# Altium project classyTKL_MX.PrjPcb
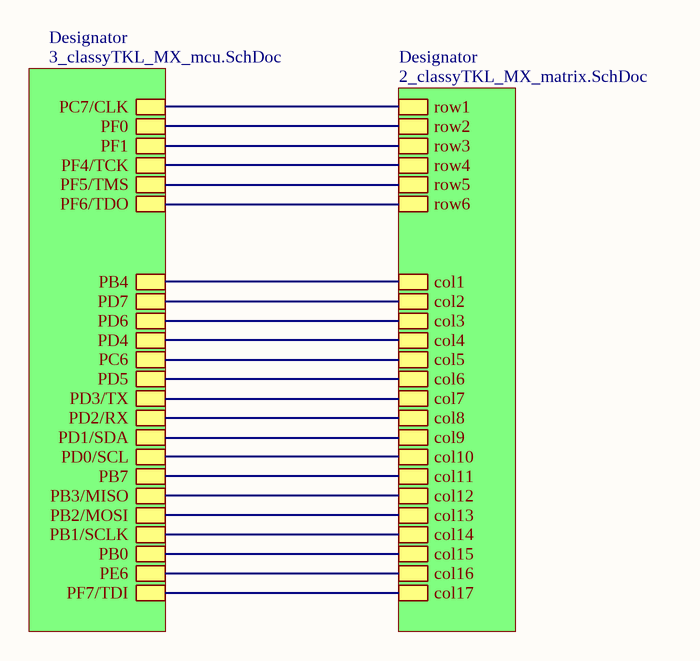
[diagram p0: 1_classyTKL_MX_top.SchDoc]
3 sheets, 205 parts. Net scope: hierarchical (ports join the sheet entries above them; power ports are global).
Board files: classyTKL_MX.PcbDoc, classyTKL_MX_plate.PcbDoc
Sheets:
  1_classyTKL_MX_top.SchDoc
    Designator = 3_classyTKL_MX_mcu.SchDoc
    Designator = 2_classyTKL_MX_matrix.SchDoc

## Sheet 1_classyTKL_MX_top.SchDoc: ClassyTKL - MX
size A4; Engineer: 4pplet; Address1: github.com/4pplet/classytkl; Address2: Licence: CERN-OHL-S; Revision: A3; SheetNumber: 1; SheetTotal: 3; ProjectName: waffling60

### Sub-sheets
Designator = 3_classyTKL_MX_mcu.SchDoc: PD5, PB4, PD6, PB0, PB2/MOSI, PB3/MISO, PD7, PC7/CLK, PE6, PF0, PF1, PF5/TMS, PD2/RX, PF4/TCK, PF7/TDI, PF6/TDO, PD4, PB1/SCLK, PD0/SCL, PC6, PB7, PD1/SDA, PD3/TX
Designator = 2_classyTKL_MX_matrix.SchDoc: col6, col8, col5, col7, col3, col2, col1, col4, col9, row3, row1, row4, row2, row6, row5, col10, col11, col14, col15, col13, col12, col16, col17

### Nets
col1: sheet Designator/PB4, sheet Designator/col1
col2: sheet Designator/PD7, sheet Designator/col2
col3: sheet Designator/PD6, sheet Designator/col3
col4: sheet Designator/PD4, sheet Designator/col4
col5: sheet Designator/PC6, sheet Designator/col5
col6: sheet Designator/PD5, sheet Designator/col6
col7: sheet Designator/PD3/TX, sheet Designator/col7
col8: sheet Designator/PD2/RX, sheet Designator/col8
col9: sheet Designator/PD1/SDA, sheet Designator/col9
col10: sheet Designator/PD0/SCL, sheet Designator/col10
col11: sheet Designator/PB7, sheet Designator/col11
col12: sheet Designator/PB3/MISO, sheet Designator/col12
col13: sheet Designator/PB2/MOSI, sheet Designator/col13
col14: sheet Designator/PB1/SCLK, sheet Designator/col14
col15: sheet Designator/PB0, sheet Designator/col15
col16: sheet Designator/PE6, sheet Designator/col16
col17: sheet Designator/PF7/TDI, sheet Designator/col17
PC7: sheet Designator/PC7/CLK, sheet Designator/row1
PF0: sheet Designator/PF0, sheet Designator/row2
PF1: sheet Designator/PF1, sheet Designator/row3
PF4: sheet Designator/PF4/TCK, sheet Designator/row4
PF5: sheet Designator/PF5/TMS, sheet Designator/row5
PF6: sheet Designator/PF6/TDO, sheet Designator/row6

### Notes on the sheet
- Title
- Size:
- Date:
- A4
- Number:
- Time:
- Revision:
- Sheet
- of
- File:

## Sheet 3_classyTKL_MX_mcu.SchDoc: ClassyTKL - MX
size A4; Address1: github.com/4pplet/classytkl; Address2: Licence: CERN-OHL-S; Revision: A3; SheetNumber: 3; SheetTotal: 3
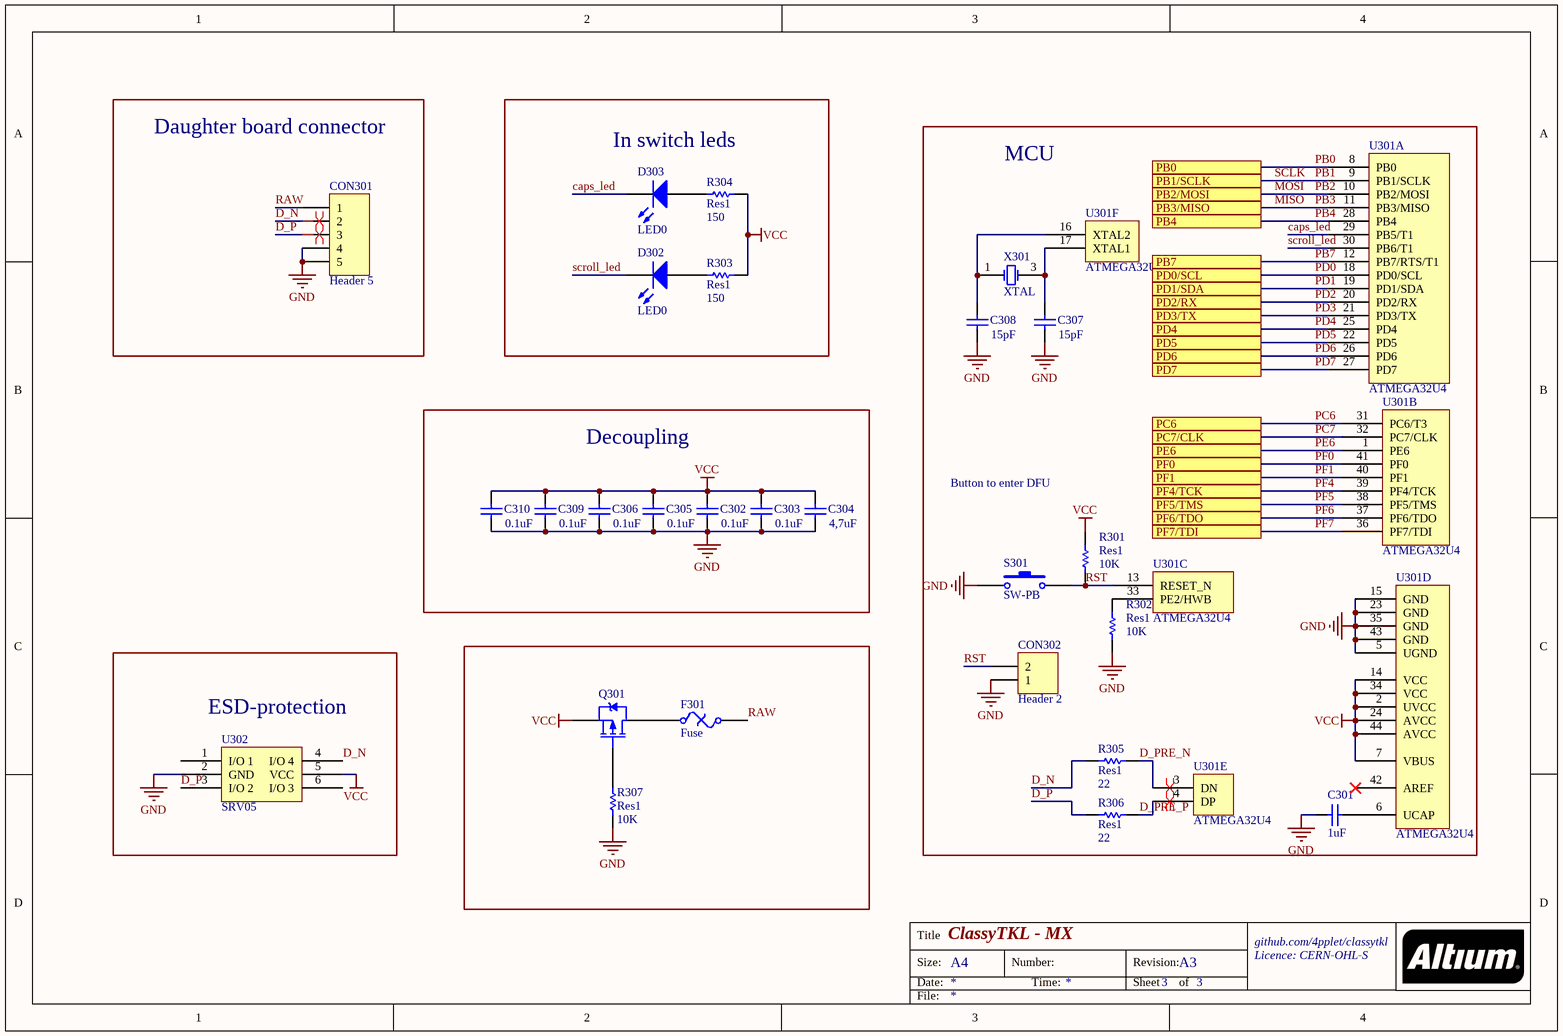
[diagram p1: 3_classyTKL_MX_mcu.SchDoc]

### Parts
C301  value 1uF  [C0603[1608]]
C302  value 0.1uF  [C0603[1608]]
C303  value 0.1uF  [C0603[1608]]
C304  value 4,7uF  [C0603[1608]]
C305  value 0.1uF  [C0603[1608]]
C306  value 0.1uF  [C0603[1608]]
C307  value 15pF  [C0603[1608]]
C308  value 15pF  [C0603[1608]]
C309  value 0.1uF  [C0603[1608]]
C310  value 0.1uF  [C0603[1608]]
CON301  Header 5  [JST SM04B-SRSS-TB]
CON302  Header 2  [HDR1X2]  (no BOM)
D302  LED0  [MX-switch - LED]  (no BOM)
D303  LED0  [MX-switch - CAPS - LED NO SWITCH]  (no BOM)
F301  Fuse  [C1206[3216]]
Q301  PMOS-2  [SOT-23-3]  (value not drawn)
R301  Res1  value 10K  [R0603[1608]]
R302  Res1  value 10K  [R0603[1608]]
R303  Res1  value 150  [R0603[1608] - THT]  (no BOM)
R304  Res1  value 150  [R0603[1608] - THT]  (no BOM)
R305  Res1  value 22  [R0603[1608]]
R306  Res1  value 22  [R0603[1608]]
R307  Res1  value 10K  [R0603[1608]]
S301  SW-PB  [XKB Switch]
U301  ATMEGA32U4  [ATMEGA32U4-COMBO]  (parts A,B,C,D,E,F of 6)
U302  SRV05  [SOT-23-6]
X301  XTAL  [XTAL-3225]

### Blocks framed on the sheet
Daughter board connector: CON301
In switch leds: D302 D303 R303 R304
MCU: C301 C307 C308 CON302 R301 R302 R305 R306 S301 U301 X301
Decoupling: C302-C306 C309 C310
ESD-protection: U302

### Ports
PB0, PB1/SCLK, PB2/MOSI, PB3/MISO, PB4, PB7, PC6, PC7/CLK, PD0/SCL, PD1/SDA, PD2/RX, PD3/TX, PD4, PD5, PD6, PD7, PE6, PF0, PF1, PF4/TCK, PF5/TMS, PF6/TDO, PF7/TDI

### Nets
GND: C301.1 C302.1 C303.1 C304.1 C305.1 C306.1 C307.1 C308.1 C309.1 C310.1 CON301.4 CON301.5 CON302.1 R302.2 R307.2 S301.2 U301.5(UGND) U301.15(GND) U301.23(GND) U301.35(GND) U301.43(GND) U302.2(GND) X301.2(GND) X301.4(GND)
VCC: C302.2 C303.2 C304.2 C305.2 C306.2 C309.2 C310.2 Q301.2(S) R301.1 R303.1 R304.1 U301.2(UVCC) U301.7(VBUS) U301.14(VCC) U301.24(AVCC) U301.34(VCC) U301.44(AVCC) U302.5(VCC)
caps_led: D303.2(K) U301.29(PB5/T1)
D_N: CON301.2 R305.2 U302.4(I/O_4)
D_P: CON301.3 R306.2 U302.3(I/O_2)
D_PRE_N: R305.1 U301.3(DN)
D_PRE_P: R306.1 U301.4(DP)
MISO: U301.11(PB3/MISO) ; port PB3/MISO  [also labelled PB3]  [project net col12]
MOSI: U301.10(PB2/MOSI) ; port PB2/MOSI  [also labelled PB2]  [project net col13]
PB0: U301.8(PB0) ; port PB0  [project net col15]
PB1: U301.9(PB1/SCLK) ; port PB1/SCLK  [also labelled SCLK]  [project net col14]
PB4: U301.28(PB4) ; port PB4  [project net col1]
PB7: U301.12(PB7/RTS/T1) ; port PB7  [project net col11]
PC6: U301.31(PC6/T3) ; port PC6  [project net col5]
PC7: U301.32(PC7/CLK) ; port PC7/CLK
PD0: U301.18(PD0/SCL) ; port PD0/SCL  [project net col10]
PD1: U301.19(PD1/SDA) ; port PD1/SDA  [project net col9]
PD2: U301.20(PD2/RX) ; port PD2/RX  [project net col8]
PD3: U301.21(PD3/TX) ; port PD3/TX  [project net col7]
PD4: U301.25(PD4) ; port PD4  [project net col4]
PD5: U301.22(PD5) ; port PD5  [project net col6]
PD6: U301.26(PD6) ; port PD6  [project net col3]
PD7: U301.27(PD7) ; port PD7  [project net col2]
PE6: U301.1(PE6) ; port PE6  [project net col16]
PF0: U301.41(PF0) ; port PF0
PF1: U301.40(PF1) ; port PF1
PF4: U301.39(PF4/TCK) ; port PF4/TCK
PF5: U301.38(PF5/TMS) ; port PF5/TMS
PF6: U301.37(PF6/TDO) ; port PF6/TDO
PF7: U301.36(PF7/TDI) ; port PF7/TDI  [project net col17]
RAW: CON301.1 F301.1
RST: CON302.2 R301.2 S301.1 U301.13(RESET_N)
scroll_led: D302.2(K) U301.30(PB6/T1)
NetC301_2: C301.2 U301.6(UCAP)
NetC307_2: C307.2 U301.17(XTAL1) X301.3(OSC2)
NetC308_2: C308.2 U301.16(XTAL2) X301.1(OSC1)
NetD302_1: D302.1(A) R303.2
NetD303_1: D303.1(A) R304.2
NetF301_2: F301.2 Q301.3(D)
NetQ301_1: Q301.1(G) R307.1
NetR302_1: R302.1 U301.33(PE2/HWB)

Not connected (* = marked no-connect by the designer): U301 42(AREF)*; U302 1(I/O_1) 6(I/O_3)

### Layout directives
differential pair: D_N, D_P, D_PRE_N, D_PRE_P

### Notes on the sheet
- Button to enter DFU
- Title
- Size:
- Date:
- A4
- Number:
- Time:
- Revision:
- Sheet
- of
- File:

### Library data of the parts
C301 = Cap: Capacitor; MRF.Part: CL10A105KB8NNNC; MFG: KEMET; MFGPN: C0603C104M5RACTU; LCSC MFG: Samsung Electro-Mechanics; Version: 0603 imperial; LCSC Part #: C15849
C302 C303 C305 C306 C309 C310 = Cap: Capacitor; MRF.Part: CC0603KRX7R9BB104; MFG: KEMET; MFGPN: C0603C104M5RACTU; LCSC MFG: YAGEO; Version: 0603 imperial; LCSC Part #: C14663
C304 = Cap: Capacitor; MRF.Part: CL10A475KO8NNNC; LCSC MFG: Samsung Electro-Mechanics; LCSC Part #: C19666
C307 C308 = Cap: Capacitor; MRF.Part: CL10C150JB8NNNC; LCSC MFG: Samsung Electro-Mechanics; Version: 0603 imperial; LCSC Part #: C1644
CON301 = Header 5: JST for USB daughter board; MFGPN: SM04B-SRSS-TB(LF)(SN); MFG: JST Sales America Inc.; LCSC MFG: JST Sales America; LCSC Part #: C160404; MRF.Part: SM04B-SRSS-TB(LF)(SN)
CON302 = Header 2: Header, 2-Pin
D302 D303 = LED0: Typical INFRARED GaAs LED
F301 = Fuse Thermal: Thermal Fuse; MRF.Part: ASMD1206-050; MFG: Bel Fuse Inc.; MFGPN: 0ZCJ0050FF2G; LCSC MFG: Shenzhen JDT Fuse; LCSC Part #: C135338
Q301 = PMOS-2: P-Channel Power MOSFET; MRF.Part: SI2301CDS-T1-GE3; LCSC MFG: Vishay Intertech; LCSC Part #: C10487; Version: SOT23-3
R301 R302 R307 = Res1: Resistor; MRF.Part: 0603WAF1002T5E; MFG: Panasonic Electronic Components; MFGPN: ERJ-3EKF5101V; LCSC MFG: Uniroyal Elec; Version: 0603 imperial; LCSC Part #: C25804
R303 R304 = Res1: Resistor; Version: 0603 imperial
R305 R306 = Res1: Resistor; MRF.Part: 0603WAF220JT5E; MFG: Panasonic Electronic Components; MFGPN: ERJ-3EKF5101V; LCSC MFG: Uniroyal Elec; Version: 0603 imperial; LCSC Part #: C23345
S301 = SW-PB: Switch; MRF.Part: TS-1187A-C-D-B; MFGPN: PTS645SM43SMTR92 LFS; MFG: C&K; LCSC MFG: XKB Enterprise; LCSC Part #: C318888
U301 = ATMEGA32U4: MCU; LCSC MFG: Microchip Tech; MFG: Microchip Technology; MFGPN: ATMEGA32U4-MUR; LCSC Part #: C45874; MRF.Part: ATMEGA32U4-MUR
U302 = SRV05: MRF.Part: SRV05-4-P-T7; LCSC MFG: ProTek Devices; LCSC Part #: C85364
X301 = XTAL: Crystal Oscillator; MRF.Part: X322516MLB4SI; LCSC MFG: Yangxing Tech; LCSC Part #: C13738

## Sheet 2_classyTKL_MX_matrix.SchDoc: ClassyTKL - MX
size A2; Address1: github.com/4pplet/classytkl; Address2: Licence: CERN-OHL-S; Revision: A3; SheetNumber: 2; SheetTotal: 3
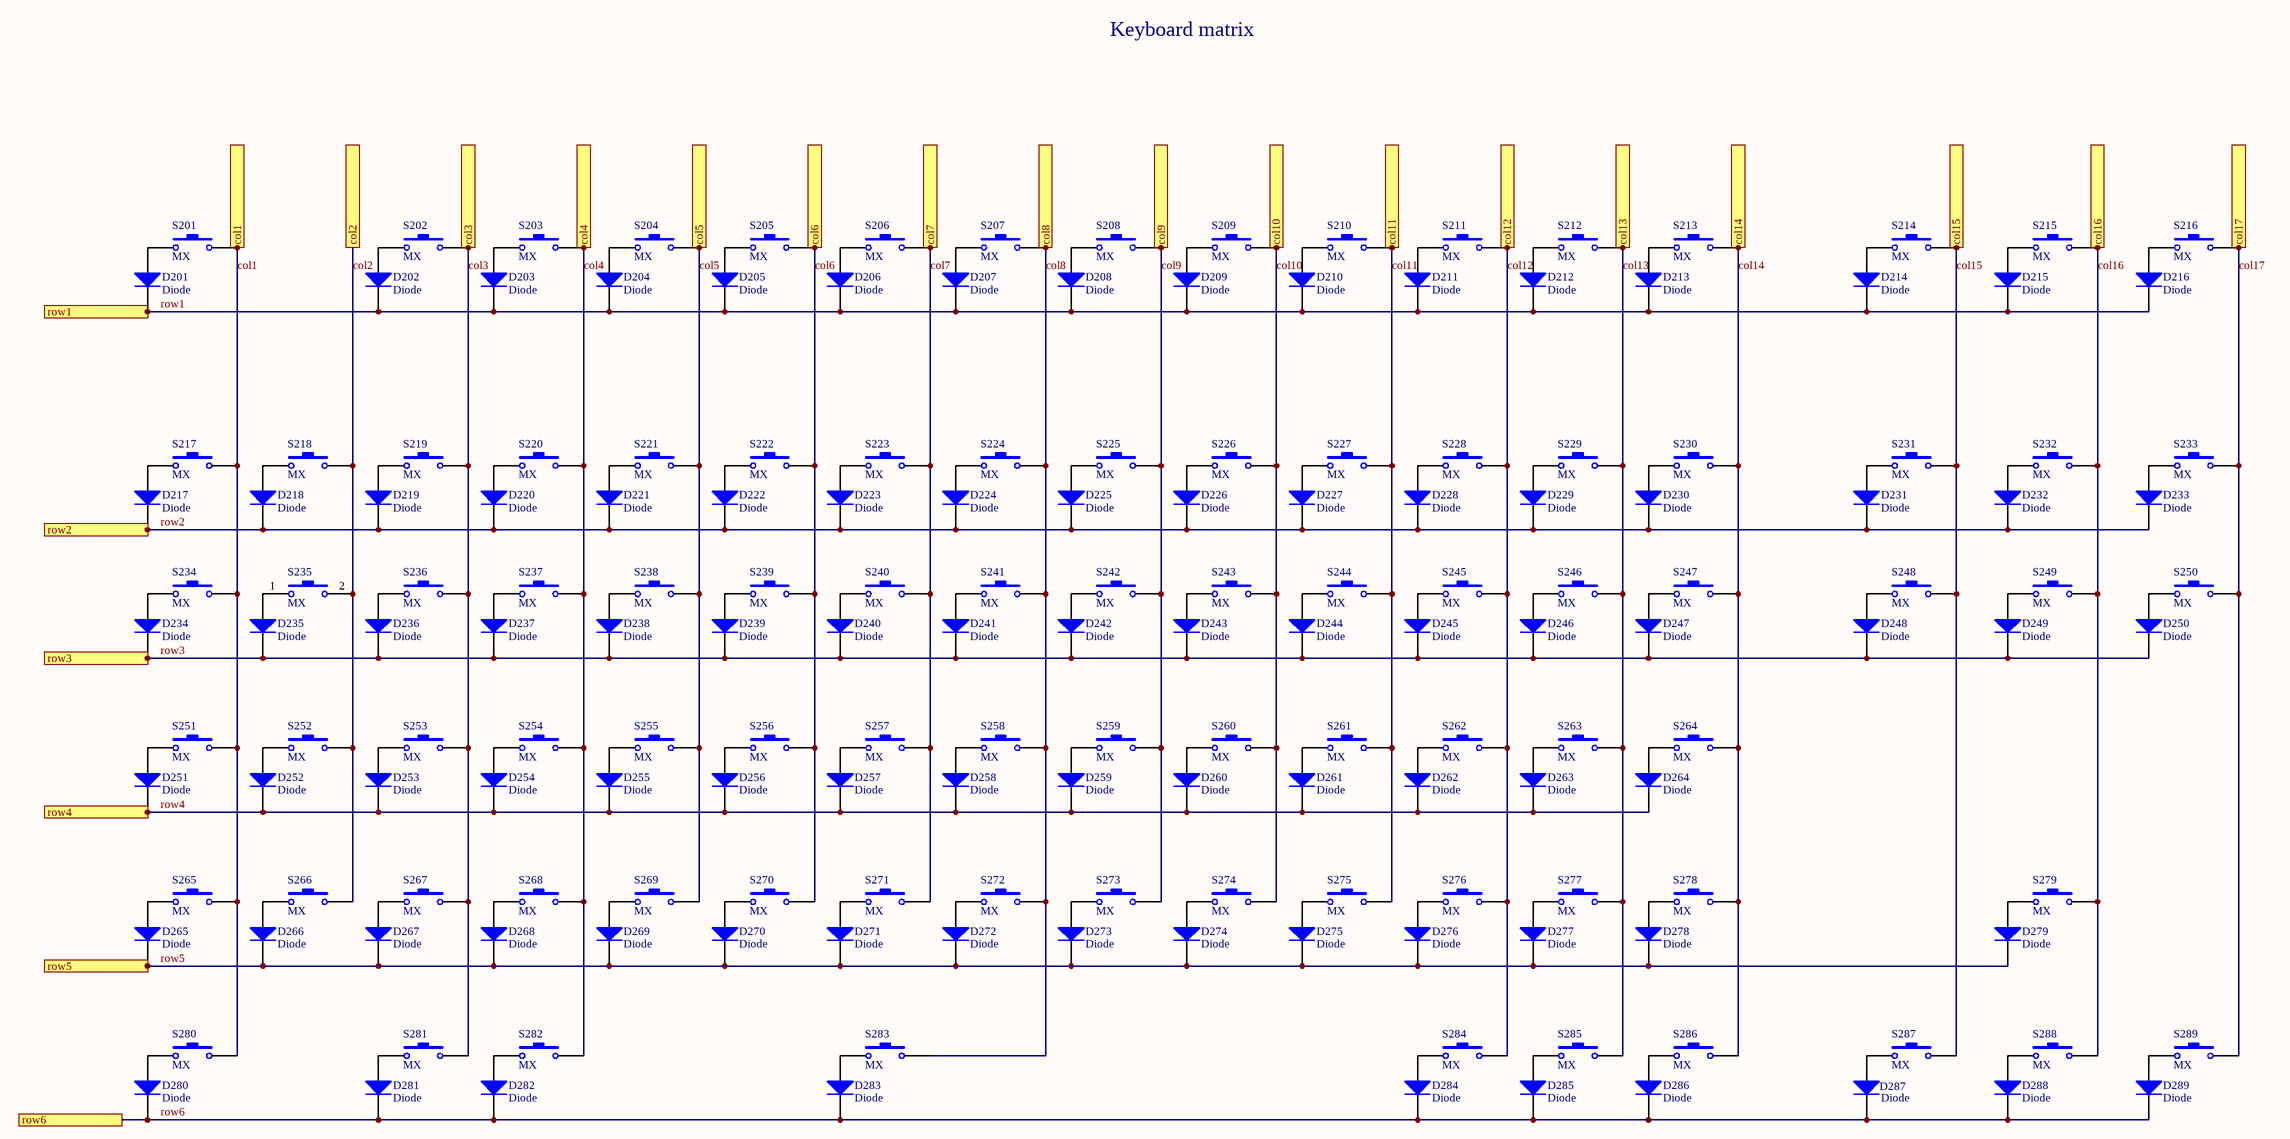
[diagram p2: 2_classyTKL_MX_matrix.SchDoc]

### Parts
D201  Diode  [SOD-123]
D202  Diode  [SOD-123]
D203  Diode  [SOD-123]
D204  Diode  [SOD-123]
D205  Diode  [SOD-123]
D206  Diode  [SOD-123]
D207  Diode  [SOD-123]
D208  Diode  [SOD-123]
D209  Diode  [SOD-123]
D210  Diode  [SOD-123]
D211  Diode  [SOD-123]
D212  Diode  [SOD-123]
D213  Diode  [SOD-123]
D214  Diode  [SOD-123]
D215  Diode  [SOD-123]
D216  Diode  [SOD-123]
D217  Diode  [SOD-123]
D218  Diode  [SOD-123]
D219  Diode  [SOD-123]
D220  Diode  [SOD-123]
D221  Diode  [SOD-123]
D222  Diode  [SOD-123]
D223  Diode  [SOD-123]
D224  Diode  [SOD-123]
D225  Diode  [SOD-123]
D226  Diode  [SOD-123]
D227  Diode  [SOD-123]
D228  Diode  [SOD-123]
D229  Diode  [SOD-123]
D230  Diode  [SOD-123]
D231  Diode  [SOD-123]
D232  Diode  [SOD-123]
D233  Diode  [SOD-123]
D234  Diode  [SOD-123]
D235  Diode  [SOD-123]
D236  Diode  [SOD-123]
D237  Diode  [SOD-123]
D238  Diode  [SOD-123]
D239  Diode  [SOD-123]
D240  Diode  [SOD-123]
D241  Diode  [SOD-123]
D242  Diode  [SOD-123]
D243  Diode  [SOD-123]
D244  Diode  [SOD-123]
D245  Diode  [SOD-123]
D246  Diode  [SOD-123]
D247  Diode  [SOD-123]
D248  Diode  [SOD-123]
D249  Diode  [SOD-123]
D250  Diode  [SOD-123]
D251  Diode  [SOD-123]
D252  Diode  [SOD-123]
D253  Diode  [SOD-123]
D254  Diode  [SOD-123]
D255  Diode  [SOD-123]
D256  Diode  [SOD-123]
D257  Diode  [SOD-123]
D258  Diode  [SOD-123]
D259  Diode  [SOD-123]
D260  Diode  [SOD-123]
D261  Diode  [SOD-123]
D262  Diode  [SOD-123]
D263  Diode  [SOD-123]
D264  Diode  [SOD-123]
D265  Diode  [SOD-123]
D266  Diode  [SOD-123]
D267  Diode  [SOD-123]
D268  Diode  [SOD-123]
D269  Diode  [SOD-123]
D270  Diode  [SOD-123]
D271  Diode  [SOD-123]
D272  Diode  [SOD-123]
D273  Diode  [SOD-123]
D274  Diode  [SOD-123]
D275  Diode  [SOD-123]
D276  Diode  [SOD-123]
D277  Diode  [SOD-123]
D278  Diode  [SOD-123]
D279  Diode  [SOD-123]
D280  Diode  [SOD-123]
D281  Diode  [SOD-123]
D282  Diode  [SOD-123]
D283  Diode  [SOD-123]
D284  Diode  [SOD-123]
D285  Diode  [SOD-123]
D286  Diode  [SOD-123]
D287  Diode  [SOD-123]
D288  Diode  [SOD-123]
D289  Diode  [SOD-123]
S201  MX  [MX-switch - switched pol]  (no BOM)
S202  MX  [MX-switch]  (no BOM)
S203  MX  [MX-switch]  (no BOM)
S204  MX  [MX-switch]  (no BOM)
S205  MX  [MX-switch - switched pol]  (no BOM)
S206  MX  [MX-switch]  (no BOM)
S207  MX  [MX-switch]  (no BOM)
S208  MX  [MX-switch]  (no BOM)
S209  MX  [MX-switch]  (no BOM)
S210  MX  [MX-switch]  (no BOM)
S211  MX  [MX-switch]  (no BOM)
S212  MX  [MX-switch]  (no BOM)
S213  MX  [MX-switch]  (no BOM)
S214  MX  [MX-switch]  (no BOM)
S215  MX  [MX-switch]  (no BOM)
S216  MX  [MX-switch]  (no BOM)
S217  MX  [MX-switch - switched pol]  (no BOM)
S218  MX  [MX-switch - switched pol]  (no BOM)
S219  MX  [MX-switch - switched pol]  (no BOM)
S220  MX  [MX-switch - switched pol]  (no BOM)
S221  MX  [MX-switch - switched pol]  (no BOM)
S222  MX  [MX-switch - switched pol]  (no BOM)
S223  MX  [MX-switch - switched pol]  (no BOM)
S224  MX  [MX-switch - switched pol]  (no BOM)
S225  MX  [MX-switch - switched pol]  (no BOM)
S226  MX  [MX-switch - switched pol]  (no BOM)
S227  MX  [MX-switch - switched pol]  (no BOM)
S228  MX  [MX-switch - switched pol]  (no BOM)
S229  MX  [MX-switch - switched pol]  (no BOM)
S230  MX  [MX-switch]  (no BOM)
S231  MX  [MX-switch]  (no BOM)
S232  MX  [MX-switch]  (no BOM)
S233  MX  [MX-switch]  (no BOM)
S234  MX  [MX-switch - 1.5U - switched pol]  (no BOM)
S235  MX  [MX-switch - switched pol]  (no BOM)
S236  MX  [MX-switch - switched pol]  (no BOM)
S237  MX  [MX-switch - switched pol]  (no BOM)
S238  MX  [MX-switch - switched pol]  (no BOM)
S239  MX  [MX-switch - switched pol]  (no BOM)
S240  MX  [MX-switch - switched pol]  (no BOM)
S241  MX  [MX-switch - switched pol]  (no BOM)
S242  MX  [MX-switch - switched pol]  (no BOM)
S243  MX  [MX-switch - switched pol]  (no BOM)
S244  MX  [MX-switch - switched pol]  (no BOM)
S245  MX  [MX-switch - switched pol]  (no BOM)
S246  MX  [MX-switch - switched pol]  (no BOM)
S247  MX  [MX-switch - PIPE_ISO_ENTER]  (no BOM)
S248  MX  [MX-switch]  (no BOM)
S249  MX  [MX-switch]  (no BOM)
S250  MX  [MX-switch]  (no BOM)
S251  MX  [MX-switch - CAPS]  (no BOM)
S252  MX  [MX-switch - switched pol]  (no BOM)
S253  MX  [MX-switch - switched pol]  (no BOM)
S254  MX  [MX-switch - switched pol]  (no BOM)
S255  MX  [MX-switch - switched pol]  (no BOM)
S256  MX  [MX-switch - switched pol]  (no BOM)
S257  MX  [MX-switch - switched pol]  (no BOM)
S258  MX  [MX-switch - switched pol]  (no BOM)
S259  MX  [MX-switch - switched pol]  (no BOM)
S260  MX  [MX-switch - switched pol]  (no BOM)
S261  MX  [MX-switch - switched pol]  (no BOM)
S262  MX  [MX-switch - switched pol]  (no BOM)
S263  MX  [MX-switch - Enter_ANSI_ISO_KEY]  (no BOM)
S264  MX  [MX-switch - backspace]  (no BOM)
S265  MX  [MX-switch - Left shift]  (no BOM)
S266  MX  [MX-switch - switched pol]  (no BOM)
S267  MX  [MX-switch - switched pol]  (no BOM)
S268  MX  [MX-switch - switched pol]  (no BOM)
S269  MX  [MX-switch - switched pol]  (no BOM)
S270  MX  [MX-switch - switched pol]  (no BOM)
S271  MX  [MX-switch - switched pol]  (no BOM)
S272  MX  [MX-switch - switched pol]  (no BOM)
S273  MX  [MX-switch - switched pol]  (no BOM)
S274  MX  [MX-switch - switched pol]  (no BOM)
S275  MX  [MX-switch - switched pol]  (no BOM)
S276  MX  [MX-switch - switched pol]  (no BOM)
S277  MX  [MX-switch - right shift]  (no BOM)
S278  MX  [MX-switch]  (no BOM)
S279  MX  [MX-switch]  (no BOM)
S280  MX  [MX-switch - 1.5U - switched pol]  (no BOM)
S281  MX  [MX-switch]  (no BOM)
S282  MX  [MX-switch - 1.5U]  (no BOM)
S283  MX  [MX-switch - 7u space]  (no BOM)
S284  MX  [MX-switch - 1.5U]  (no BOM)
S285  MX  [MX-switch]  (no BOM)
S286  MX  [MX-switch - 1.5U]  (no BOM)
S287  MX  [MX-switch]  (no BOM)
S288  MX  [MX-switch]  (no BOM)
S289  MX  [MX-switch]  (no BOM)

### Ports
col1, col2, col3, col4, col5, col6, col7, col8, col9, col10, col11, col12, col13, col14, col15, col16, col17, row1, row2, row3, row4, row5, row6

### Nets
col1: S201.2 S217.2 S234.2 S251.2 S265.2 S280.2 ; port col1
col2: S218.2 S235.2 S252.2 S266.2 ; port col2
col3: S202.2 S219.2 S236.2 S253.2 S267.2 S281.2 ; port col3
col4: S203.2 S220.2 S237.2 S254.2 S268.2 S282.2 ; port col4
col5: S204.2 S221.2 S238.2 S255.2 S269.2 ; port col5
col6: S205.2 S222.2 S239.2 S256.2 S270.2 ; port col6
col7: S206.2 S223.2 S240.2 S257.2 S271.2 ; port col7
col8: S207.2 S224.2 S241.2 S258.2 S272.2 S283.2 ; port col8
col9: S208.2 S225.2 S242.2 S259.2 S273.2 ; port col9
col10: S209.2 S226.2 S243.2 S260.2 S274.2 ; port col10
col11: S210.2 S227.2 S244.2 S261.2 S275.2 ; port col11
col12: S211.2 S228.2 S245.2 S262.2 S276.2 S284.2 ; port col12
col13: S212.2 S229.2 S246.2 S263.2 S277.2 S285.2 ; port col13
col14: S213.2 S230.2 S247.2 S264.2 S278.2 S286.2 ; port col14
col15: S214.2 S231.2 S248.2 S287.2 ; port col15
col16: S215.2 S232.2 S249.2 S279.2 S288.2 ; port col16
col17: S216.2 S233.2 S250.2 S289.2 ; port col17
row1: D201.2(K) D202.2(K) D203.2(K) D204.2(K) D205.2(K) D206.2(K) D207.2(K) D208.2(K) D209.2(K) D210.2(K) D211.2(K) D212.2(K) D213.2(K) D214.2(K) D215.2(K) D216.2(K) ; port row1  [project net PC7]
row2: D217.2(K) D218.2(K) D219.2(K) D220.2(K) D221.2(K) D222.2(K) D223.2(K) D224.2(K) D225.2(K) D226.2(K) D227.2(K) D228.2(K) D229.2(K) D230.2(K) D231.2(K) D232.2(K) D233.2(K) ; port row2  [project net PF0]
row3: D234.2(K) D235.2(K) D236.2(K) D237.2(K) D238.2(K) D239.2(K) D240.2(K) D241.2(K) D242.2(K) D243.2(K) D244.2(K) D245.2(K) D246.2(K) D247.2(K) D248.2(K) D249.2(K) D250.2(K) ; port row3  [project net PF1]
row4: D251.2(K) D252.2(K) D253.2(K) D254.2(K) D255.2(K) D256.2(K) D257.2(K) D258.2(K) D259.2(K) D260.2(K) D261.2(K) D262.2(K) D263.2(K) D264.2(K) ; port row4  [project net PF4]
row5: D265.2(K) D266.2(K) D267.2(K) D268.2(K) D269.2(K) D270.2(K) D271.2(K) D272.2(K) D273.2(K) D274.2(K) D275.2(K) D276.2(K) D277.2(K) D278.2(K) D279.2(K) ; port row5  [project net PF5]
row6: D280.2(K) D281.2(K) D282.2(K) D283.2(K) D284.2(K) D285.2(K) D286.2(K) D287.2(K) D288.2(K) D289.2(K) ; port row6  [project net PF6]
NetD201_1: D201.1(A) S201.1
NetD202_1: D202.1(A) S202.1
NetD203_1: D203.1(A) S203.1
NetD204_1: D204.1(A) S204.1
NetD205_1: D205.1(A) S205.1
NetD206_1: D206.1(A) S206.1
NetD207_1: D207.1(A) S207.1
NetD208_1: D208.1(A) S208.1
NetD209_1: D209.1(A) S209.1
NetD210_1: D210.1(A) S210.1
NetD211_1: D211.1(A) S211.1
NetD212_1: D212.1(A) S212.1
NetD213_1: D213.1(A) S213.1
NetD214_1: D214.1(A) S214.1
NetD215_1: D215.1(A) S215.1
NetD216_1: D216.1(A) S216.1
NetD217_1: D217.1(A) S217.1
NetD218_1: D218.1(A) S218.1
NetD219_1: D219.1(A) S219.1
NetD220_1: D220.1(A) S220.1
NetD221_1: D221.1(A) S221.1
NetD222_1: D222.1(A) S222.1
NetD223_1: D223.1(A) S223.1
NetD224_1: D224.1(A) S224.1
NetD225_1: D225.1(A) S225.1
NetD226_1: D226.1(A) S226.1
NetD227_1: D227.1(A) S227.1
NetD228_1: D228.1(A) S228.1
NetD229_1: D229.1(A) S229.1
NetD230_1: D230.1(A) S230.1
NetD231_1: D231.1(A) S231.1
NetD232_1: D232.1(A) S232.1
NetD233_1: D233.1(A) S233.1
NetD234_1: D234.1(A) S234.1
NetD235_1: D235.1(A) S235.1
NetD236_1: D236.1(A) S236.1
NetD237_1: D237.1(A) S237.1
NetD238_1: D238.1(A) S238.1
NetD239_1: D239.1(A) S239.1
NetD240_1: D240.1(A) S240.1
NetD241_1: D241.1(A) S241.1
NetD242_1: D242.1(A) S242.1
NetD243_1: D243.1(A) S243.1
NetD244_1: D244.1(A) S244.1
NetD245_1: D245.1(A) S245.1
NetD246_1: D246.1(A) S246.1
NetD247_1: D247.1(A) S247.1
NetD248_1: D248.1(A) S248.1
NetD249_1: D249.1(A) S249.1
NetD250_1: D250.1(A) S250.1
NetD251_1: D251.1(A) S251.1
NetD252_1: D252.1(A) S252.1
NetD253_1: D253.1(A) S253.1
NetD254_1: D254.1(A) S254.1
NetD255_1: D255.1(A) S255.1
NetD256_1: D256.1(A) S256.1
NetD257_1: D257.1(A) S257.1
NetD258_1: D258.1(A) S258.1
NetD259_1: D259.1(A) S259.1
NetD260_1: D260.1(A) S260.1
NetD261_1: D261.1(A) S261.1
NetD262_1: D262.1(A) S262.1
NetD263_1: D263.1(A) S263.1
NetD264_1: D264.1(A) S264.1
NetD265_1: D265.1(A) S265.1
NetD266_1: D266.1(A) S266.1
NetD267_1: D267.1(A) S267.1
NetD268_1: D268.1(A) S268.1
NetD269_1: D269.1(A) S269.1
NetD270_1: D270.1(A) S270.1
NetD271_1: D271.1(A) S271.1
NetD272_1: D272.1(A) S272.1
NetD273_1: D273.1(A) S273.1
NetD274_1: D274.1(A) S274.1
NetD275_1: D275.1(A) S275.1
NetD276_1: D276.1(A) S276.1
NetD277_1: D277.1(A) S277.1
NetD278_1: D278.1(A) S278.1
NetD279_1: D279.1(A) S279.1
NetD280_1: D280.1(A) S280.1
NetD281_1: D281.1(A) S281.1
NetD282_1: D282.1(A) S282.1
NetD283_1: D283.1(A) S283.1
NetD284_1: D284.1(A) S284.1
NetD285_1: D285.1(A) S285.1
NetD286_1: D286.1(A) S286.1
NetD287_1: D287.1(A) S287.1
NetD288_1: D288.1(A) S288.1
NetD289_1: D289.1(A) S289.1

### Notes on the sheet
- Keyboard matrix
- Title
- Size:
- Date:
- File:
- A2
- Number:
- Time:
- Revision:
- Sheet
- of

### Library data of the parts
D201-D289 = Diode: Default Diode; MRF.Part: 1N4148W; LCSC MFG: ST(Semtech); Version: SOD-123; LCSC Part #: C81598
S201-S233 S235-S289 = SW-PB: Switch
S234 = SW-PB: TAB

## Nets that join several sheets
col1: 3_classyTKL_MX_mcu (U301.28), 2_classyTKL_MX_matrix (6 pins)
col2: 3_classyTKL_MX_mcu (U301.27), 2_classyTKL_MX_matrix (S218.2 S235.2 S252.2 S266.2)
col3: 3_classyTKL_MX_mcu (U301.26), 2_classyTKL_MX_matrix (6 pins)
col4: 3_classyTKL_MX_mcu (U301.25), 2_classyTKL_MX_matrix (6 pins)
col5: 3_classyTKL_MX_mcu (U301.31), 2_classyTKL_MX_matrix (5 pins)
col6: 3_classyTKL_MX_mcu (U301.22), 2_classyTKL_MX_matrix (5 pins)
col7: 3_classyTKL_MX_mcu (U301.21), 2_classyTKL_MX_matrix (5 pins)
col8: 3_classyTKL_MX_mcu (U301.20), 2_classyTKL_MX_matrix (6 pins)
col9: 3_classyTKL_MX_mcu (U301.19), 2_classyTKL_MX_matrix (5 pins)
col10: 3_classyTKL_MX_mcu (U301.18), 2_classyTKL_MX_matrix (5 pins)
col11: 3_classyTKL_MX_mcu (U301.12), 2_classyTKL_MX_matrix (5 pins)
col12: 3_classyTKL_MX_mcu (U301.11), 2_classyTKL_MX_matrix (6 pins)
col13: 3_classyTKL_MX_mcu (U301.10), 2_classyTKL_MX_matrix (6 pins)
col14: 3_classyTKL_MX_mcu (U301.9), 2_classyTKL_MX_matrix (6 pins)
col15: 3_classyTKL_MX_mcu (U301.8), 2_classyTKL_MX_matrix (S214.2 S231.2 S248.2 S287.2)
col16: 3_classyTKL_MX_mcu (U301.1), 2_classyTKL_MX_matrix (5 pins)
col17: 3_classyTKL_MX_mcu (U301.36), 2_classyTKL_MX_matrix (S216.2 S233.2 S250.2 S289.2)
PC7: 3_classyTKL_MX_mcu (U301.32), 2_classyTKL_MX_matrix (16 pins)
PF0: 3_classyTKL_MX_mcu (U301.41), 2_classyTKL_MX_matrix (17 pins)
PF1: 3_classyTKL_MX_mcu (U301.40), 2_classyTKL_MX_matrix (17 pins)
PF4: 3_classyTKL_MX_mcu (U301.39), 2_classyTKL_MX_matrix (14 pins)
PF5: 3_classyTKL_MX_mcu (U301.38), 2_classyTKL_MX_matrix (15 pins)
PF6: 3_classyTKL_MX_mcu (U301.37), 2_classyTKL_MX_matrix (10 pins)